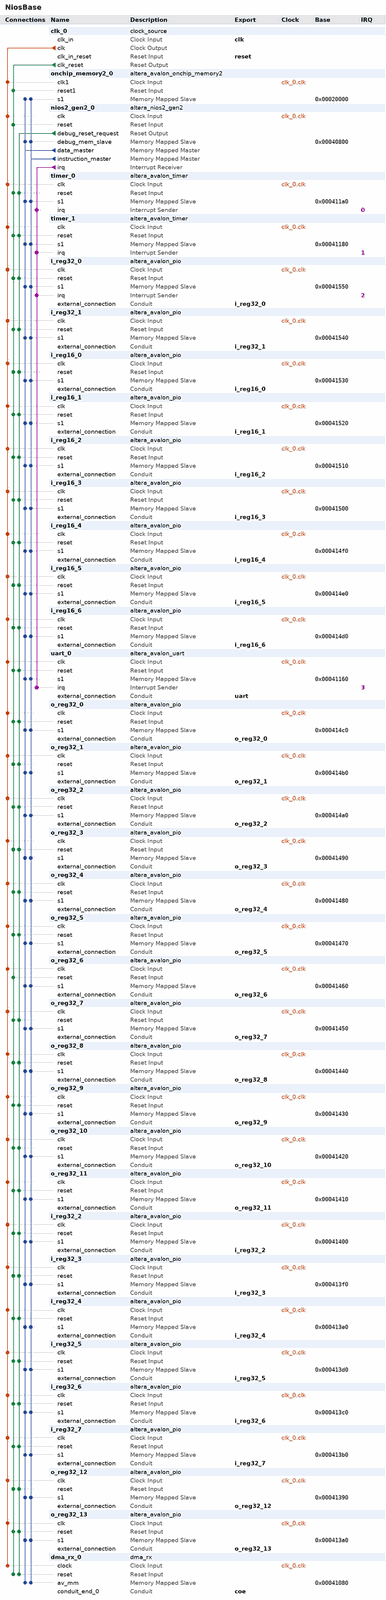
[diagram p0: system contents, whole]
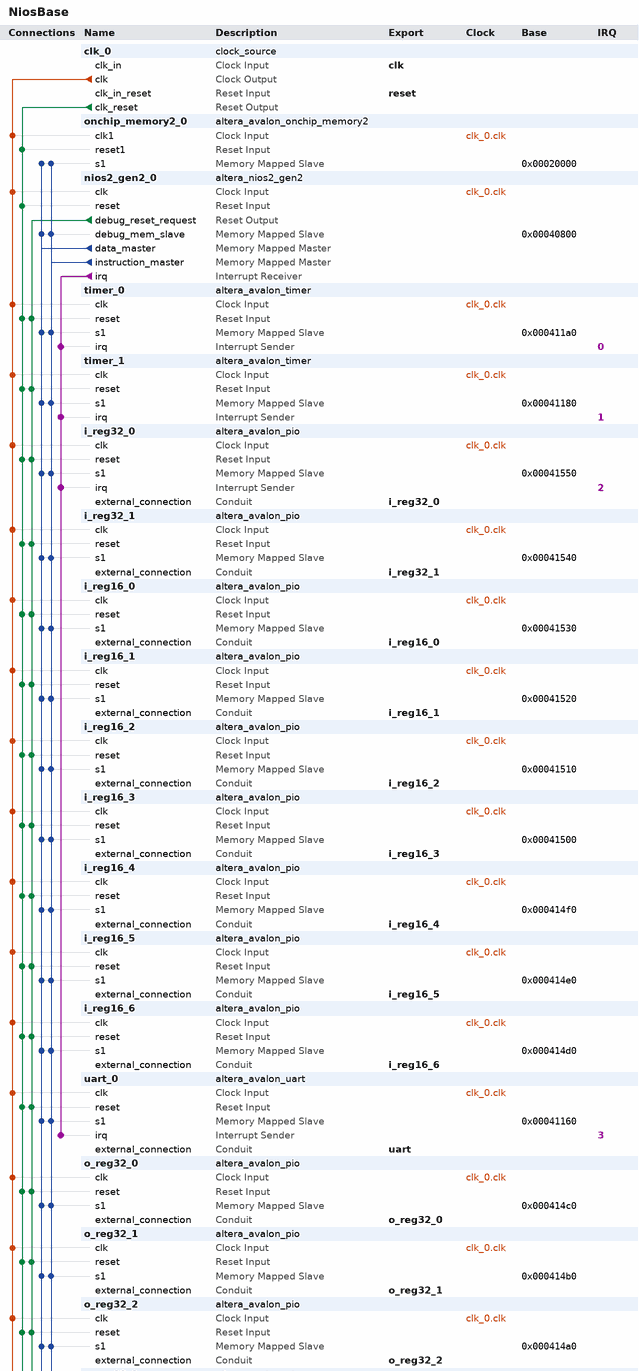
[diagram p1: system contents, upper part]
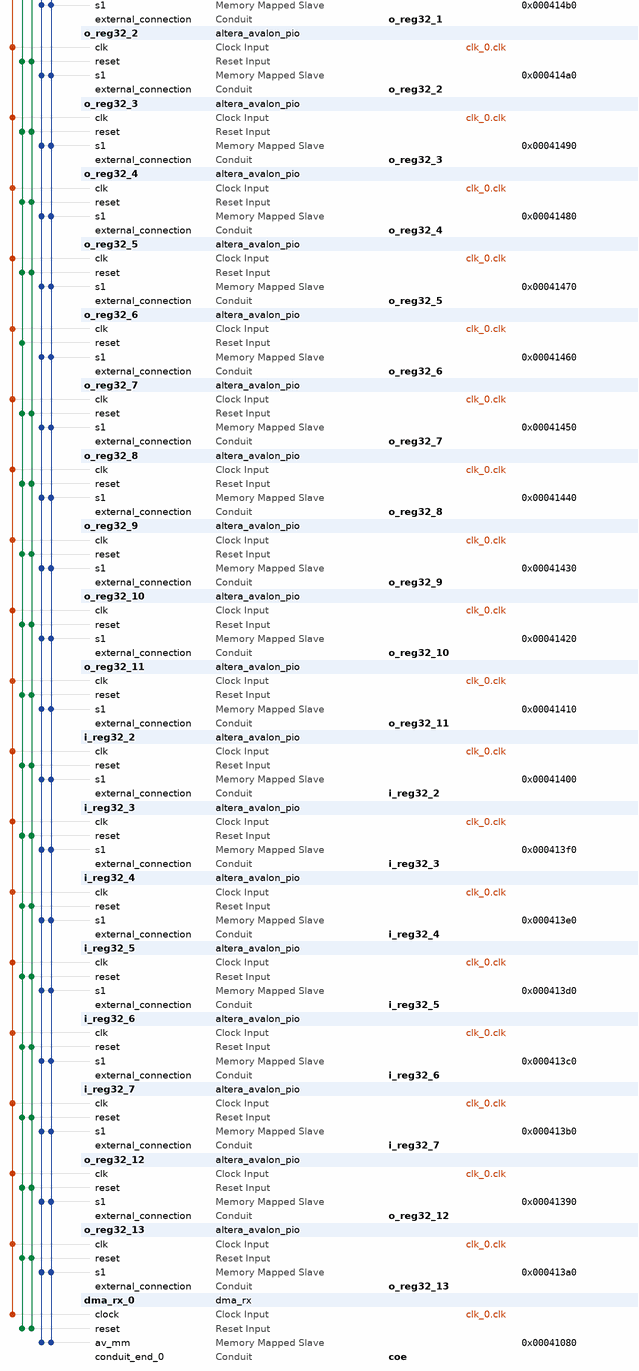
[diagram p2: system contents, lower part]
# Platform Designer (Qsys) system NiosBase, Cyclone V 5CSEBA6U23I7
# Parameters at their usual value, and those the tool derives, are not listed.
package require -exact qsys 20.1
create_system NiosBase
set_project_property DEVICE_FAMILY {Cyclone V}
set_project_property DEVICE 5CSEBA6U23I7

add_instance clk_0 clock_source 20.1
set_instance_parameter_value clk_0 clockFrequency 50000000

add_instance onchip_memory2_0 altera_avalon_onchip_memory2 20.1
set_instance_parameter_value onchip_memory2_0 dataWidth 32
set_instance_parameter_value onchip_memory2_0 dualPort false
set_instance_parameter_value onchip_memory2_0 initMemContent true
set_instance_parameter_value onchip_memory2_0 initializationFileName C:/intelProjects/nios_monitor/quartus/software/nios_monitor/mem_init/NiosBase_onchip_memory2_0.hex
set_instance_parameter_value onchip_memory2_0 memorySize 131072
set_instance_parameter_value onchip_memory2_0 useNonDefaultInitFile true

add_instance nios2_gen2_0 altera_nios2_gen2 20.1
set_instance_parameter_value nios2_gen2_0 dcache_size 2048
set_instance_parameter_value nios2_gen2_0 exceptionSlave onchip_memory2_0.s1
set_instance_parameter_value nios2_gen2_0 icache_size 4096
set_instance_parameter_value nios2_gen2_0 impl Tiny
set_instance_parameter_value nios2_gen2_0 resetSlave onchip_memory2_0.s1

add_instance timer_0 altera_avalon_timer 20.1
set_instance_parameter_value timer_0 period 1
set_instance_parameter_value timer_0 periodUnits MSEC

add_instance timer_1 altera_avalon_timer 20.1
set_instance_parameter_value timer_1 period 10
set_instance_parameter_value timer_1 periodUnits MSEC

add_instance i_reg32_0 altera_avalon_pio 20.1
set_instance_parameter_value i_reg32_0 bitClearingEdgeCapReg true
set_instance_parameter_value i_reg32_0 captureEdge true
set_instance_parameter_value i_reg32_0 direction Input
set_instance_parameter_value i_reg32_0 generateIRQ true
set_instance_parameter_value i_reg32_0 width 32

add_instance i_reg32_1 altera_avalon_pio 20.1
set_instance_parameter_value i_reg32_1 bitClearingEdgeCapReg true
set_instance_parameter_value i_reg32_1 direction Input
set_instance_parameter_value i_reg32_1 width 32

add_instance i_reg16_0 altera_avalon_pio 20.1
set_instance_parameter_value i_reg16_0 bitClearingEdgeCapReg true
set_instance_parameter_value i_reg16_0 direction Input
set_instance_parameter_value i_reg16_0 width 16

add_instance i_reg16_1 altera_avalon_pio 20.1
set_instance_parameter_value i_reg16_1 bitClearingEdgeCapReg true
set_instance_parameter_value i_reg16_1 direction Input
set_instance_parameter_value i_reg16_1 width 16

add_instance i_reg16_2 altera_avalon_pio 20.1
set_instance_parameter_value i_reg16_2 bitClearingEdgeCapReg true
set_instance_parameter_value i_reg16_2 direction Input
set_instance_parameter_value i_reg16_2 width 16

add_instance i_reg16_3 altera_avalon_pio 20.1
set_instance_parameter_value i_reg16_3 bitClearingEdgeCapReg true
set_instance_parameter_value i_reg16_3 direction Input
set_instance_parameter_value i_reg16_3 width 16

add_instance i_reg16_4 altera_avalon_pio 20.1
set_instance_parameter_value i_reg16_4 bitClearingEdgeCapReg true
set_instance_parameter_value i_reg16_4 direction Input
set_instance_parameter_value i_reg16_4 width 16

add_instance i_reg16_5 altera_avalon_pio 20.1
set_instance_parameter_value i_reg16_5 bitClearingEdgeCapReg true
set_instance_parameter_value i_reg16_5 direction Input
set_instance_parameter_value i_reg16_5 width 16

add_instance i_reg16_6 altera_avalon_pio 20.1
set_instance_parameter_value i_reg16_6 bitClearingEdgeCapReg true
set_instance_parameter_value i_reg16_6 direction Input
set_instance_parameter_value i_reg16_6 width 16

add_instance uart_0 altera_avalon_uart 20.1
set_instance_parameter_value uart_0 baud 115200
set_instance_parameter_value uart_0 dataBits 8
set_instance_parameter_value uart_0 fixedBaud true
set_instance_parameter_value uart_0 parity NONE
set_instance_parameter_value uart_0 stopBits 1

add_instance o_reg32_0 altera_avalon_pio 20.1
set_instance_parameter_value o_reg32_0 direction Output
set_instance_parameter_value o_reg32_0 width 32

add_instance o_reg32_1 altera_avalon_pio 20.1
set_instance_parameter_value o_reg32_1 direction Output
set_instance_parameter_value o_reg32_1 width 32

add_instance o_reg32_2 altera_avalon_pio 20.1
set_instance_parameter_value o_reg32_2 direction Output
set_instance_parameter_value o_reg32_2 width 32

add_instance o_reg32_3 altera_avalon_pio 20.1
set_instance_parameter_value o_reg32_3 direction Output
set_instance_parameter_value o_reg32_3 width 32

add_instance o_reg32_4 altera_avalon_pio 20.1
set_instance_parameter_value o_reg32_4 direction Output
set_instance_parameter_value o_reg32_4 width 32

add_instance o_reg32_5 altera_avalon_pio 20.1
set_instance_parameter_value o_reg32_5 direction Output
set_instance_parameter_value o_reg32_5 width 32

add_instance o_reg32_6 altera_avalon_pio 20.1
set_instance_parameter_value o_reg32_6 direction Output
set_instance_parameter_value o_reg32_6 width 32

add_instance o_reg32_7 altera_avalon_pio 20.1
set_instance_parameter_value o_reg32_7 direction Output
set_instance_parameter_value o_reg32_7 width 32

add_instance o_reg32_8 altera_avalon_pio 20.1
set_instance_parameter_value o_reg32_8 direction Output
set_instance_parameter_value o_reg32_8 width 32

add_instance o_reg32_9 altera_avalon_pio 20.1
set_instance_parameter_value o_reg32_9 direction Output
set_instance_parameter_value o_reg32_9 width 32

add_instance o_reg32_10 altera_avalon_pio 20.1
set_instance_parameter_value o_reg32_10 direction Output
set_instance_parameter_value o_reg32_10 width 32

add_instance o_reg32_11 altera_avalon_pio 20.1
set_instance_parameter_value o_reg32_11 direction Output
set_instance_parameter_value o_reg32_11 width 32

add_instance i_reg32_2 altera_avalon_pio 20.1
set_instance_parameter_value i_reg32_2 bitClearingEdgeCapReg true
set_instance_parameter_value i_reg32_2 direction Input
set_instance_parameter_value i_reg32_2 width 32

add_instance i_reg32_3 altera_avalon_pio 20.1
set_instance_parameter_value i_reg32_3 bitClearingEdgeCapReg true
set_instance_parameter_value i_reg32_3 direction Input
set_instance_parameter_value i_reg32_3 width 32

add_instance i_reg32_4 altera_avalon_pio 20.1
set_instance_parameter_value i_reg32_4 bitClearingEdgeCapReg true
set_instance_parameter_value i_reg32_4 direction Input
set_instance_parameter_value i_reg32_4 width 32

add_instance i_reg32_5 altera_avalon_pio 20.1
set_instance_parameter_value i_reg32_5 bitClearingEdgeCapReg true
set_instance_parameter_value i_reg32_5 direction Input
set_instance_parameter_value i_reg32_5 width 32

add_instance i_reg32_6 altera_avalon_pio 20.1
set_instance_parameter_value i_reg32_6 bitClearingEdgeCapReg true
set_instance_parameter_value i_reg32_6 direction Input
set_instance_parameter_value i_reg32_6 width 32

add_instance i_reg32_7 altera_avalon_pio 20.1
set_instance_parameter_value i_reg32_7 bitClearingEdgeCapReg true
set_instance_parameter_value i_reg32_7 direction Input
set_instance_parameter_value i_reg32_7 width 32

add_instance o_reg32_12 altera_avalon_pio 20.1
set_instance_parameter_value o_reg32_12 direction Output
set_instance_parameter_value o_reg32_12 width 32

add_instance o_reg32_13 altera_avalon_pio 20.1
set_instance_parameter_value o_reg32_13 direction Output
set_instance_parameter_value o_reg32_13 width 32

add_instance dma_rx_0 dma_rx 1.0
set_instance_parameter_value dma_rx_0 DEPTH 32
set_instance_parameter_value dma_rx_0 WATCHDOG_nsec 100000
set_instance_parameter_value dma_rx_0 clock_nsec 20

# connections
add_connection clk_0.clk dma_rx_0.clock clock
add_connection clk_0.clk i_reg16_0.clk clock
add_connection clk_0.clk i_reg16_1.clk clock
add_connection clk_0.clk i_reg16_2.clk clock
add_connection clk_0.clk i_reg16_3.clk clock
add_connection clk_0.clk i_reg16_4.clk clock
add_connection clk_0.clk i_reg16_5.clk clock
add_connection clk_0.clk i_reg16_6.clk clock
add_connection clk_0.clk i_reg32_0.clk clock
add_connection clk_0.clk i_reg32_1.clk clock
add_connection clk_0.clk i_reg32_2.clk clock
add_connection clk_0.clk i_reg32_3.clk clock
add_connection clk_0.clk i_reg32_4.clk clock
add_connection clk_0.clk i_reg32_5.clk clock
add_connection clk_0.clk i_reg32_6.clk clock
add_connection clk_0.clk i_reg32_7.clk clock
add_connection clk_0.clk nios2_gen2_0.clk clock
add_connection clk_0.clk o_reg32_0.clk clock
add_connection clk_0.clk o_reg32_1.clk clock
add_connection clk_0.clk o_reg32_2.clk clock
add_connection clk_0.clk o_reg32_3.clk clock
add_connection clk_0.clk o_reg32_4.clk clock
add_connection clk_0.clk o_reg32_5.clk clock
add_connection clk_0.clk o_reg32_6.clk clock
add_connection clk_0.clk o_reg32_7.clk clock
add_connection clk_0.clk o_reg32_8.clk clock
add_connection clk_0.clk o_reg32_9.clk clock
add_connection clk_0.clk o_reg32_10.clk clock
add_connection clk_0.clk o_reg32_11.clk clock
add_connection clk_0.clk o_reg32_12.clk clock
add_connection clk_0.clk o_reg32_13.clk clock
add_connection clk_0.clk onchip_memory2_0.clk1 clock
add_connection clk_0.clk timer_0.clk clock
add_connection clk_0.clk timer_1.clk clock
add_connection clk_0.clk uart_0.clk clock
add_connection clk_0.clk_reset dma_rx_0.reset reset
add_connection clk_0.clk_reset i_reg16_0.reset reset
add_connection clk_0.clk_reset i_reg16_1.reset reset
add_connection clk_0.clk_reset i_reg16_2.reset reset
add_connection clk_0.clk_reset i_reg16_3.reset reset
add_connection clk_0.clk_reset i_reg16_4.reset reset
add_connection clk_0.clk_reset i_reg16_5.reset reset
add_connection clk_0.clk_reset i_reg16_6.reset reset
add_connection clk_0.clk_reset i_reg32_0.reset reset
add_connection clk_0.clk_reset i_reg32_1.reset reset
add_connection clk_0.clk_reset i_reg32_2.reset reset
add_connection clk_0.clk_reset i_reg32_3.reset reset
add_connection clk_0.clk_reset i_reg32_4.reset reset
add_connection clk_0.clk_reset i_reg32_5.reset reset
add_connection clk_0.clk_reset i_reg32_6.reset reset
add_connection clk_0.clk_reset i_reg32_7.reset reset
add_connection clk_0.clk_reset nios2_gen2_0.reset reset
add_connection clk_0.clk_reset o_reg32_0.reset reset
add_connection clk_0.clk_reset o_reg32_1.reset reset
add_connection clk_0.clk_reset o_reg32_2.reset reset
add_connection clk_0.clk_reset o_reg32_3.reset reset
add_connection clk_0.clk_reset o_reg32_4.reset reset
add_connection clk_0.clk_reset o_reg32_5.reset reset
add_connection clk_0.clk_reset o_reg32_6.reset reset
add_connection clk_0.clk_reset o_reg32_7.reset reset
add_connection clk_0.clk_reset o_reg32_8.reset reset
add_connection clk_0.clk_reset o_reg32_9.reset reset
add_connection clk_0.clk_reset o_reg32_10.reset reset
add_connection clk_0.clk_reset o_reg32_11.reset reset
add_connection clk_0.clk_reset o_reg32_12.reset reset
add_connection clk_0.clk_reset o_reg32_13.reset reset
add_connection clk_0.clk_reset onchip_memory2_0.reset1 reset
add_connection clk_0.clk_reset timer_0.reset reset
add_connection clk_0.clk_reset timer_1.reset reset
add_connection clk_0.clk_reset uart_0.reset reset
add_connection nios2_gen2_0.debug_reset_request dma_rx_0.reset reset
add_connection nios2_gen2_0.debug_reset_request i_reg16_0.reset reset
add_connection nios2_gen2_0.debug_reset_request i_reg16_1.reset reset
add_connection nios2_gen2_0.debug_reset_request i_reg16_2.reset reset
add_connection nios2_gen2_0.debug_reset_request i_reg16_3.reset reset
add_connection nios2_gen2_0.debug_reset_request i_reg16_4.reset reset
add_connection nios2_gen2_0.debug_reset_request i_reg16_5.reset reset
add_connection nios2_gen2_0.debug_reset_request i_reg16_6.reset reset
add_connection nios2_gen2_0.debug_reset_request i_reg32_0.reset reset
add_connection nios2_gen2_0.debug_reset_request i_reg32_1.reset reset
add_connection nios2_gen2_0.debug_reset_request i_reg32_2.reset reset
add_connection nios2_gen2_0.debug_reset_request i_reg32_3.reset reset
add_connection nios2_gen2_0.debug_reset_request i_reg32_4.reset reset
add_connection nios2_gen2_0.debug_reset_request i_reg32_5.reset reset
add_connection nios2_gen2_0.debug_reset_request i_reg32_6.reset reset
add_connection nios2_gen2_0.debug_reset_request i_reg32_7.reset reset
add_connection nios2_gen2_0.debug_reset_request o_reg32_0.reset reset
add_connection nios2_gen2_0.debug_reset_request o_reg32_1.reset reset
add_connection nios2_gen2_0.debug_reset_request o_reg32_2.reset reset
add_connection nios2_gen2_0.debug_reset_request o_reg32_3.reset reset
add_connection nios2_gen2_0.debug_reset_request o_reg32_4.reset reset
add_connection nios2_gen2_0.debug_reset_request o_reg32_5.reset reset
add_connection nios2_gen2_0.debug_reset_request o_reg32_7.reset reset
add_connection nios2_gen2_0.debug_reset_request o_reg32_8.reset reset
add_connection nios2_gen2_0.debug_reset_request o_reg32_9.reset reset
add_connection nios2_gen2_0.debug_reset_request o_reg32_10.reset reset
add_connection nios2_gen2_0.debug_reset_request o_reg32_11.reset reset
add_connection nios2_gen2_0.debug_reset_request o_reg32_12.reset reset
add_connection nios2_gen2_0.debug_reset_request o_reg32_13.reset reset
add_connection nios2_gen2_0.debug_reset_request timer_0.reset reset
add_connection nios2_gen2_0.debug_reset_request timer_1.reset reset
add_connection nios2_gen2_0.debug_reset_request uart_0.reset reset
add_connection nios2_gen2_0.data_master dma_rx_0.av_mm avalon
set_connection_parameter_value nios2_gen2_0.data_master/dma_rx_0.av_mm baseAddress 0x00041080
add_connection nios2_gen2_0.data_master i_reg16_0.s1 avalon
set_connection_parameter_value nios2_gen2_0.data_master/i_reg16_0.s1 baseAddress 0x00041530
add_connection nios2_gen2_0.data_master i_reg16_1.s1 avalon
set_connection_parameter_value nios2_gen2_0.data_master/i_reg16_1.s1 baseAddress 0x00041520
add_connection nios2_gen2_0.data_master i_reg16_2.s1 avalon
set_connection_parameter_value nios2_gen2_0.data_master/i_reg16_2.s1 baseAddress 0x00041510
add_connection nios2_gen2_0.data_master i_reg16_3.s1 avalon
set_connection_parameter_value nios2_gen2_0.data_master/i_reg16_3.s1 baseAddress 0x00041500
add_connection nios2_gen2_0.data_master i_reg16_4.s1 avalon
set_connection_parameter_value nios2_gen2_0.data_master/i_reg16_4.s1 baseAddress 0x000414f0
add_connection nios2_gen2_0.data_master i_reg16_5.s1 avalon
set_connection_parameter_value nios2_gen2_0.data_master/i_reg16_5.s1 baseAddress 0x000414e0
add_connection nios2_gen2_0.data_master i_reg16_6.s1 avalon
set_connection_parameter_value nios2_gen2_0.data_master/i_reg16_6.s1 baseAddress 0x000414d0
add_connection nios2_gen2_0.data_master i_reg32_0.s1 avalon
set_connection_parameter_value nios2_gen2_0.data_master/i_reg32_0.s1 baseAddress 0x00041550
add_connection nios2_gen2_0.data_master i_reg32_1.s1 avalon
set_connection_parameter_value nios2_gen2_0.data_master/i_reg32_1.s1 baseAddress 0x00041540
add_connection nios2_gen2_0.data_master i_reg32_2.s1 avalon
set_connection_parameter_value nios2_gen2_0.data_master/i_reg32_2.s1 baseAddress 0x00041400
add_connection nios2_gen2_0.data_master i_reg32_3.s1 avalon
set_connection_parameter_value nios2_gen2_0.data_master/i_reg32_3.s1 baseAddress 0x000413f0
add_connection nios2_gen2_0.data_master i_reg32_4.s1 avalon
set_connection_parameter_value nios2_gen2_0.data_master/i_reg32_4.s1 baseAddress 0x000413e0
add_connection nios2_gen2_0.data_master i_reg32_5.s1 avalon
set_connection_parameter_value nios2_gen2_0.data_master/i_reg32_5.s1 baseAddress 0x000413d0
add_connection nios2_gen2_0.data_master i_reg32_6.s1 avalon
set_connection_parameter_value nios2_gen2_0.data_master/i_reg32_6.s1 baseAddress 0x000413c0
add_connection nios2_gen2_0.data_master i_reg32_7.s1 avalon
set_connection_parameter_value nios2_gen2_0.data_master/i_reg32_7.s1 baseAddress 0x000413b0
add_connection nios2_gen2_0.data_master nios2_gen2_0.debug_mem_slave avalon
set_connection_parameter_value nios2_gen2_0.data_master/nios2_gen2_0.debug_mem_slave baseAddress 0x00040800
add_connection nios2_gen2_0.data_master o_reg32_0.s1 avalon
set_connection_parameter_value nios2_gen2_0.data_master/o_reg32_0.s1 baseAddress 0x000414c0
add_connection nios2_gen2_0.data_master o_reg32_1.s1 avalon
set_connection_parameter_value nios2_gen2_0.data_master/o_reg32_1.s1 baseAddress 0x000414b0
add_connection nios2_gen2_0.data_master o_reg32_2.s1 avalon
set_connection_parameter_value nios2_gen2_0.data_master/o_reg32_2.s1 baseAddress 0x000414a0
add_connection nios2_gen2_0.data_master o_reg32_3.s1 avalon
set_connection_parameter_value nios2_gen2_0.data_master/o_reg32_3.s1 baseAddress 0x00041490
add_connection nios2_gen2_0.data_master o_reg32_4.s1 avalon
set_connection_parameter_value nios2_gen2_0.data_master/o_reg32_4.s1 baseAddress 0x00041480
add_connection nios2_gen2_0.data_master o_reg32_5.s1 avalon
set_connection_parameter_value nios2_gen2_0.data_master/o_reg32_5.s1 baseAddress 0x00041470
add_connection nios2_gen2_0.data_master o_reg32_6.s1 avalon
set_connection_parameter_value nios2_gen2_0.data_master/o_reg32_6.s1 baseAddress 0x00041460
add_connection nios2_gen2_0.data_master o_reg32_7.s1 avalon
set_connection_parameter_value nios2_gen2_0.data_master/o_reg32_7.s1 baseAddress 0x00041450
add_connection nios2_gen2_0.data_master o_reg32_8.s1 avalon
set_connection_parameter_value nios2_gen2_0.data_master/o_reg32_8.s1 baseAddress 0x00041440
add_connection nios2_gen2_0.data_master o_reg32_9.s1 avalon
set_connection_parameter_value nios2_gen2_0.data_master/o_reg32_9.s1 baseAddress 0x00041430
add_connection nios2_gen2_0.data_master o_reg32_10.s1 avalon
set_connection_parameter_value nios2_gen2_0.data_master/o_reg32_10.s1 baseAddress 0x00041420
add_connection nios2_gen2_0.data_master o_reg32_11.s1 avalon
set_connection_parameter_value nios2_gen2_0.data_master/o_reg32_11.s1 baseAddress 0x00041410
add_connection nios2_gen2_0.data_master o_reg32_12.s1 avalon
set_connection_parameter_value nios2_gen2_0.data_master/o_reg32_12.s1 baseAddress 0x00041390
add_connection nios2_gen2_0.data_master o_reg32_13.s1 avalon
set_connection_parameter_value nios2_gen2_0.data_master/o_reg32_13.s1 baseAddress 0x000413a0
add_connection nios2_gen2_0.data_master onchip_memory2_0.s1 avalon
set_connection_parameter_value nios2_gen2_0.data_master/onchip_memory2_0.s1 baseAddress 0x00020000
add_connection nios2_gen2_0.data_master timer_0.s1 avalon
set_connection_parameter_value nios2_gen2_0.data_master/timer_0.s1 baseAddress 0x000411a0
add_connection nios2_gen2_0.data_master timer_1.s1 avalon
set_connection_parameter_value nios2_gen2_0.data_master/timer_1.s1 baseAddress 0x00041180
add_connection nios2_gen2_0.data_master uart_0.s1 avalon
set_connection_parameter_value nios2_gen2_0.data_master/uart_0.s1 baseAddress 0x00041160
add_connection nios2_gen2_0.instruction_master dma_rx_0.av_mm avalon
set_connection_parameter_value nios2_gen2_0.instruction_master/dma_rx_0.av_mm baseAddress 0x00041080
add_connection nios2_gen2_0.instruction_master i_reg16_0.s1 avalon
set_connection_parameter_value nios2_gen2_0.instruction_master/i_reg16_0.s1 baseAddress 0x00041530
add_connection nios2_gen2_0.instruction_master i_reg16_1.s1 avalon
set_connection_parameter_value nios2_gen2_0.instruction_master/i_reg16_1.s1 baseAddress 0x00041520
add_connection nios2_gen2_0.instruction_master i_reg16_2.s1 avalon
set_connection_parameter_value nios2_gen2_0.instruction_master/i_reg16_2.s1 baseAddress 0x00041510
add_connection nios2_gen2_0.instruction_master i_reg16_3.s1 avalon
set_connection_parameter_value nios2_gen2_0.instruction_master/i_reg16_3.s1 baseAddress 0x00041500
add_connection nios2_gen2_0.instruction_master i_reg16_4.s1 avalon
set_connection_parameter_value nios2_gen2_0.instruction_master/i_reg16_4.s1 baseAddress 0x000414f0
add_connection nios2_gen2_0.instruction_master i_reg16_5.s1 avalon
set_connection_parameter_value nios2_gen2_0.instruction_master/i_reg16_5.s1 baseAddress 0x000414e0
add_connection nios2_gen2_0.instruction_master i_reg16_6.s1 avalon
set_connection_parameter_value nios2_gen2_0.instruction_master/i_reg16_6.s1 baseAddress 0x000414d0
add_connection nios2_gen2_0.instruction_master i_reg32_0.s1 avalon
set_connection_parameter_value nios2_gen2_0.instruction_master/i_reg32_0.s1 baseAddress 0x00041550
add_connection nios2_gen2_0.instruction_master i_reg32_1.s1 avalon
set_connection_parameter_value nios2_gen2_0.instruction_master/i_reg32_1.s1 baseAddress 0x00041540
add_connection nios2_gen2_0.instruction_master i_reg32_2.s1 avalon
set_connection_parameter_value nios2_gen2_0.instruction_master/i_reg32_2.s1 baseAddress 0x00041400
add_connection nios2_gen2_0.instruction_master i_reg32_3.s1 avalon
set_connection_parameter_value nios2_gen2_0.instruction_master/i_reg32_3.s1 baseAddress 0x000413f0
add_connection nios2_gen2_0.instruction_master i_reg32_4.s1 avalon
set_connection_parameter_value nios2_gen2_0.instruction_master/i_reg32_4.s1 baseAddress 0x000413e0
add_connection nios2_gen2_0.instruction_master i_reg32_5.s1 avalon
set_connection_parameter_value nios2_gen2_0.instruction_master/i_reg32_5.s1 baseAddress 0x000413d0
add_connection nios2_gen2_0.instruction_master i_reg32_6.s1 avalon
set_connection_parameter_value nios2_gen2_0.instruction_master/i_reg32_6.s1 baseAddress 0x000413c0
add_connection nios2_gen2_0.instruction_master i_reg32_7.s1 avalon
set_connection_parameter_value nios2_gen2_0.instruction_master/i_reg32_7.s1 baseAddress 0x000413b0
add_connection nios2_gen2_0.instruction_master nios2_gen2_0.debug_mem_slave avalon
set_connection_parameter_value nios2_gen2_0.instruction_master/nios2_gen2_0.debug_mem_slave baseAddress 0x00040800
add_connection nios2_gen2_0.instruction_master o_reg32_0.s1 avalon
set_connection_parameter_value nios2_gen2_0.instruction_master/o_reg32_0.s1 baseAddress 0x000414c0
add_connection nios2_gen2_0.instruction_master o_reg32_1.s1 avalon
set_connection_parameter_value nios2_gen2_0.instruction_master/o_reg32_1.s1 baseAddress 0x000414b0
add_connection nios2_gen2_0.instruction_master o_reg32_2.s1 avalon
set_connection_parameter_value nios2_gen2_0.instruction_master/o_reg32_2.s1 baseAddress 0x000414a0
add_connection nios2_gen2_0.instruction_master o_reg32_3.s1 avalon
set_connection_parameter_value nios2_gen2_0.instruction_master/o_reg32_3.s1 baseAddress 0x00041490
add_connection nios2_gen2_0.instruction_master o_reg32_4.s1 avalon
set_connection_parameter_value nios2_gen2_0.instruction_master/o_reg32_4.s1 baseAddress 0x00041480
add_connection nios2_gen2_0.instruction_master o_reg32_5.s1 avalon
set_connection_parameter_value nios2_gen2_0.instruction_master/o_reg32_5.s1 baseAddress 0x00041470
add_connection nios2_gen2_0.instruction_master o_reg32_6.s1 avalon
set_connection_parameter_value nios2_gen2_0.instruction_master/o_reg32_6.s1 baseAddress 0x00041460
add_connection nios2_gen2_0.instruction_master o_reg32_7.s1 avalon
set_connection_parameter_value nios2_gen2_0.instruction_master/o_reg32_7.s1 baseAddress 0x00041450
add_connection nios2_gen2_0.instruction_master o_reg32_8.s1 avalon
set_connection_parameter_value nios2_gen2_0.instruction_master/o_reg32_8.s1 baseAddress 0x00041440
add_connection nios2_gen2_0.instruction_master o_reg32_9.s1 avalon
set_connection_parameter_value nios2_gen2_0.instruction_master/o_reg32_9.s1 baseAddress 0x00041430
add_connection nios2_gen2_0.instruction_master o_reg32_10.s1 avalon
set_connection_parameter_value nios2_gen2_0.instruction_master/o_reg32_10.s1 baseAddress 0x00041420
add_connection nios2_gen2_0.instruction_master o_reg32_11.s1 avalon
set_connection_parameter_value nios2_gen2_0.instruction_master/o_reg32_11.s1 baseAddress 0x00041410
add_connection nios2_gen2_0.instruction_master o_reg32_12.s1 avalon
set_connection_parameter_value nios2_gen2_0.instruction_master/o_reg32_12.s1 baseAddress 0x00041390
add_connection nios2_gen2_0.instruction_master o_reg32_13.s1 avalon
set_connection_parameter_value nios2_gen2_0.instruction_master/o_reg32_13.s1 baseAddress 0x000413a0
add_connection nios2_gen2_0.instruction_master onchip_memory2_0.s1 avalon
set_connection_parameter_value nios2_gen2_0.instruction_master/onchip_memory2_0.s1 baseAddress 0x00020000
add_connection nios2_gen2_0.instruction_master timer_0.s1 avalon
set_connection_parameter_value nios2_gen2_0.instruction_master/timer_0.s1 baseAddress 0x000411a0
add_connection nios2_gen2_0.instruction_master timer_1.s1 avalon
set_connection_parameter_value nios2_gen2_0.instruction_master/timer_1.s1 baseAddress 0x00041180
add_connection nios2_gen2_0.instruction_master uart_0.s1 avalon
set_connection_parameter_value nios2_gen2_0.instruction_master/uart_0.s1 baseAddress 0x00041160
add_connection nios2_gen2_0.irq i_reg32_0.irq interrupt
set_connection_parameter_value nios2_gen2_0.irq/i_reg32_0.irq irqNumber 2
add_connection nios2_gen2_0.irq timer_0.irq interrupt
set_connection_parameter_value nios2_gen2_0.irq/timer_0.irq irqNumber 0
add_connection nios2_gen2_0.irq timer_1.irq interrupt
set_connection_parameter_value nios2_gen2_0.irq/timer_1.irq irqNumber 1
add_connection nios2_gen2_0.irq uart_0.irq interrupt
set_connection_parameter_value nios2_gen2_0.irq/uart_0.irq irqNumber 3

# exported interfaces
add_interface clk clock sink
set_interface_property clk EXPORT_OF clk_0.clk_in
add_interface coe conduit end
set_interface_property coe EXPORT_OF dma_rx_0.conduit_end_0
add_interface i_reg16_0 conduit end
set_interface_property i_reg16_0 EXPORT_OF i_reg16_0.external_connection
add_interface i_reg16_1 conduit end
set_interface_property i_reg16_1 EXPORT_OF i_reg16_1.external_connection
add_interface i_reg16_2 conduit end
set_interface_property i_reg16_2 EXPORT_OF i_reg16_2.external_connection
add_interface i_reg16_3 conduit end
set_interface_property i_reg16_3 EXPORT_OF i_reg16_3.external_connection
add_interface i_reg16_4 conduit end
set_interface_property i_reg16_4 EXPORT_OF i_reg16_4.external_connection
add_interface i_reg16_5 conduit end
set_interface_property i_reg16_5 EXPORT_OF i_reg16_5.external_connection
add_interface i_reg16_6 conduit end
set_interface_property i_reg16_6 EXPORT_OF i_reg16_6.external_connection
add_interface i_reg32_0 conduit end
set_interface_property i_reg32_0 EXPORT_OF i_reg32_0.external_connection
add_interface i_reg32_1 conduit end
set_interface_property i_reg32_1 EXPORT_OF i_reg32_1.external_connection
add_interface i_reg32_2 conduit end
set_interface_property i_reg32_2 EXPORT_OF i_reg32_2.external_connection
add_interface i_reg32_3 conduit end
set_interface_property i_reg32_3 EXPORT_OF i_reg32_3.external_connection
add_interface i_reg32_4 conduit end
set_interface_property i_reg32_4 EXPORT_OF i_reg32_4.external_connection
add_interface i_reg32_5 conduit end
set_interface_property i_reg32_5 EXPORT_OF i_reg32_5.external_connection
add_interface i_reg32_6 conduit end
set_interface_property i_reg32_6 EXPORT_OF i_reg32_6.external_connection
add_interface i_reg32_7 conduit end
set_interface_property i_reg32_7 EXPORT_OF i_reg32_7.external_connection
add_interface o_reg32_0 conduit end
set_interface_property o_reg32_0 EXPORT_OF o_reg32_0.external_connection
add_interface o_reg32_1 conduit end
set_interface_property o_reg32_1 EXPORT_OF o_reg32_1.external_connection
add_interface o_reg32_10 conduit end
set_interface_property o_reg32_10 EXPORT_OF o_reg32_10.external_connection
add_interface o_reg32_11 conduit end
set_interface_property o_reg32_11 EXPORT_OF o_reg32_11.external_connection
add_interface o_reg32_12 conduit end
set_interface_property o_reg32_12 EXPORT_OF o_reg32_12.external_connection
add_interface o_reg32_13 conduit end
set_interface_property o_reg32_13 EXPORT_OF o_reg32_13.external_connection
add_interface o_reg32_2 conduit end
set_interface_property o_reg32_2 EXPORT_OF o_reg32_2.external_connection
add_interface o_reg32_3 conduit end
set_interface_property o_reg32_3 EXPORT_OF o_reg32_3.external_connection
add_interface o_reg32_4 conduit end
set_interface_property o_reg32_4 EXPORT_OF o_reg32_4.external_connection
add_interface o_reg32_5 conduit end
set_interface_property o_reg32_5 EXPORT_OF o_reg32_5.external_connection
add_interface o_reg32_6 conduit end
set_interface_property o_reg32_6 EXPORT_OF o_reg32_6.external_connection
add_interface o_reg32_7 conduit end
set_interface_property o_reg32_7 EXPORT_OF o_reg32_7.external_connection
add_interface o_reg32_8 conduit end
set_interface_property o_reg32_8 EXPORT_OF o_reg32_8.external_connection
add_interface o_reg32_9 conduit end
set_interface_property o_reg32_9 EXPORT_OF o_reg32_9.external_connection
add_interface reset reset sink
set_interface_property reset EXPORT_OF clk_0.clk_in_reset
add_interface uart conduit end
set_interface_property uart EXPORT_OF uart_0.external_connection

set_interconnect_requirement {$system} qsys_mm.clockCrossingAdapter HANDSHAKE
set_interconnect_requirement {$system} qsys_mm.enableEccProtection FALSE
set_interconnect_requirement {$system} qsys_mm.insertDefaultSlave FALSE
set_interconnect_requirement {$system} qsys_mm.maxAdditionalLatency 1

save_system NiosBase.qsys
